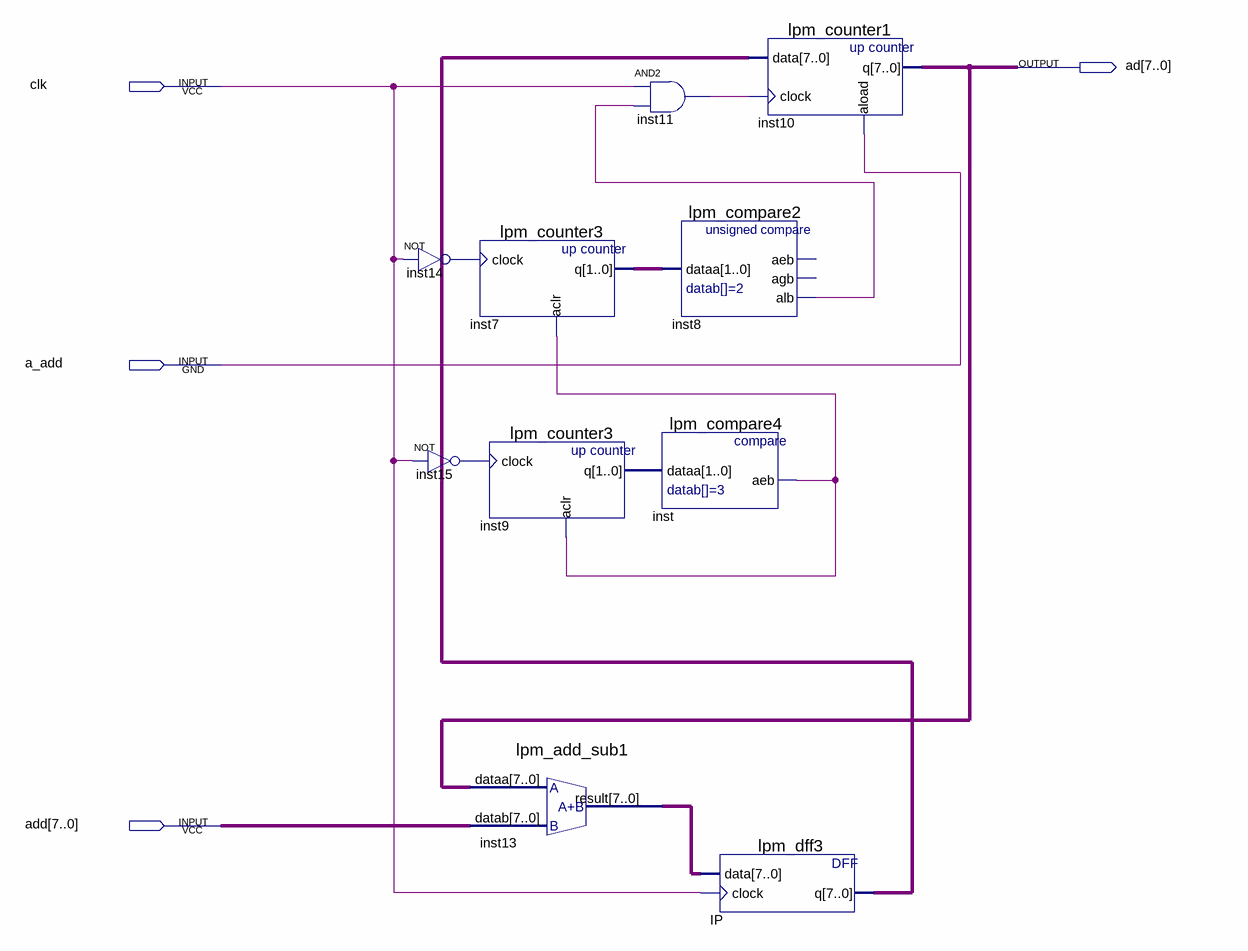
[diagram p0: schematic sheet]
// Quartus schematic IP.bdf as structural Verilog: 10 symbols, 4 pins
module IP (
  input  clk,
  input  a_add,
  input  [7:0] add,
  output [7:0] ad
);

  wire inst8_alb, inst11_out, inst14_out, inst15_out, inst_aeb;
  wire [1:0] inst7_q, inst9_q;
  wire [7:0] inst13_result, IP_q;

  not inst14 (inst14_out, clk);
  lpm_counter3 inst7 (.clock(inst14_out), .aclr(inst_aeb), .q(inst7_q));
  lpm_counter3 inst9 (.clock(inst15_out), .aclr(inst_aeb), .q(inst9_q));
  not inst15 (inst15_out, clk);
  lpm_add_sub1 inst13 (.dataa(ad), .datab(add), .result(inst13_result));
  and inst11 (inst11_out, clk, inst8_alb);
  lpm_compare2 inst8 (.dataa(inst7_q), .alb(inst8_alb));  // open: aeb, agb
  lpm_compare4 inst (.dataa(inst9_q), .aeb(inst_aeb));
  lpm_dff3 IP (.data(inst13_result), .clock(clk), .q(IP_q));
  lpm_counter1 inst10 (.data(IP_q), .clock(inst11_out), .aload(a_add), .q(ad));
endmodule
